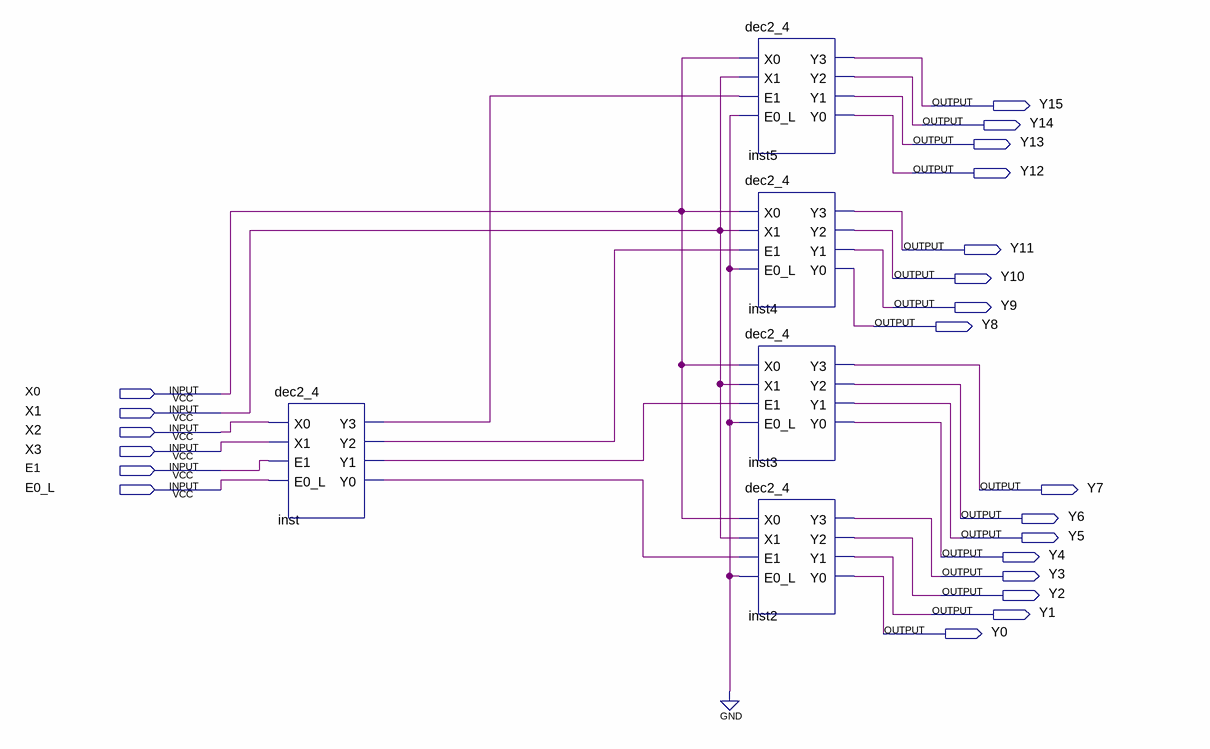
[diagram p0: schematic sheet]
// Quartus schematic Block5.bdf as structural Verilog: 5 symbols, 22 pins
module Block5 (
  input  X0,
  input  X1,
  input  X2,
  input  X3,
  input  E1,
  input  E0_L,
  output Y15,
  output Y14,
  output Y13,
  output Y12,
  output Y11,
  output Y10,
  output Y9,
  output Y8,
  output Y7,
  output Y6,
  output Y5,
  output Y4,
  output Y3,
  output Y2,
  output Y1,
  output Y0
);

  wire inst_y0, inst_y1, inst_y2, inst_y3;

  dec2_4 inst (.X0(X2), .X1(X3), .E1(E1), .E0_L(E0_L), .Y3(inst_y3), .Y2(inst_y2), .Y1(inst_y1), .Y0(inst_y0));
  dec2_4 inst5 (.X0(X0), .X1(X1), .E1(inst_y3), .E0_L(1'b0), .Y3(Y15), .Y2(Y14), .Y1(Y13), .Y0(Y12));
  dec2_4 inst4 (.X0(X0), .X1(X1), .E1(inst_y2), .E0_L(1'b0), .Y3(Y11), .Y2(Y10), .Y1(Y9), .Y0(Y8));
  dec2_4 inst3 (.X0(X0), .X1(X1), .E1(inst_y1), .E0_L(1'b0), .Y3(Y7), .Y2(Y6), .Y1(Y5), .Y0(Y4));
  dec2_4 inst2 (.X0(X0), .X1(X1), .E1(inst_y0), .E0_L(1'b0), .Y3(Y3), .Y2(Y2), .Y1(Y1), .Y0(Y0));
endmodule
